# EAGLE design Rocket-Switch-Interface_1.011 (EAGLE 9.6.2)
AUTHOR: ladyada
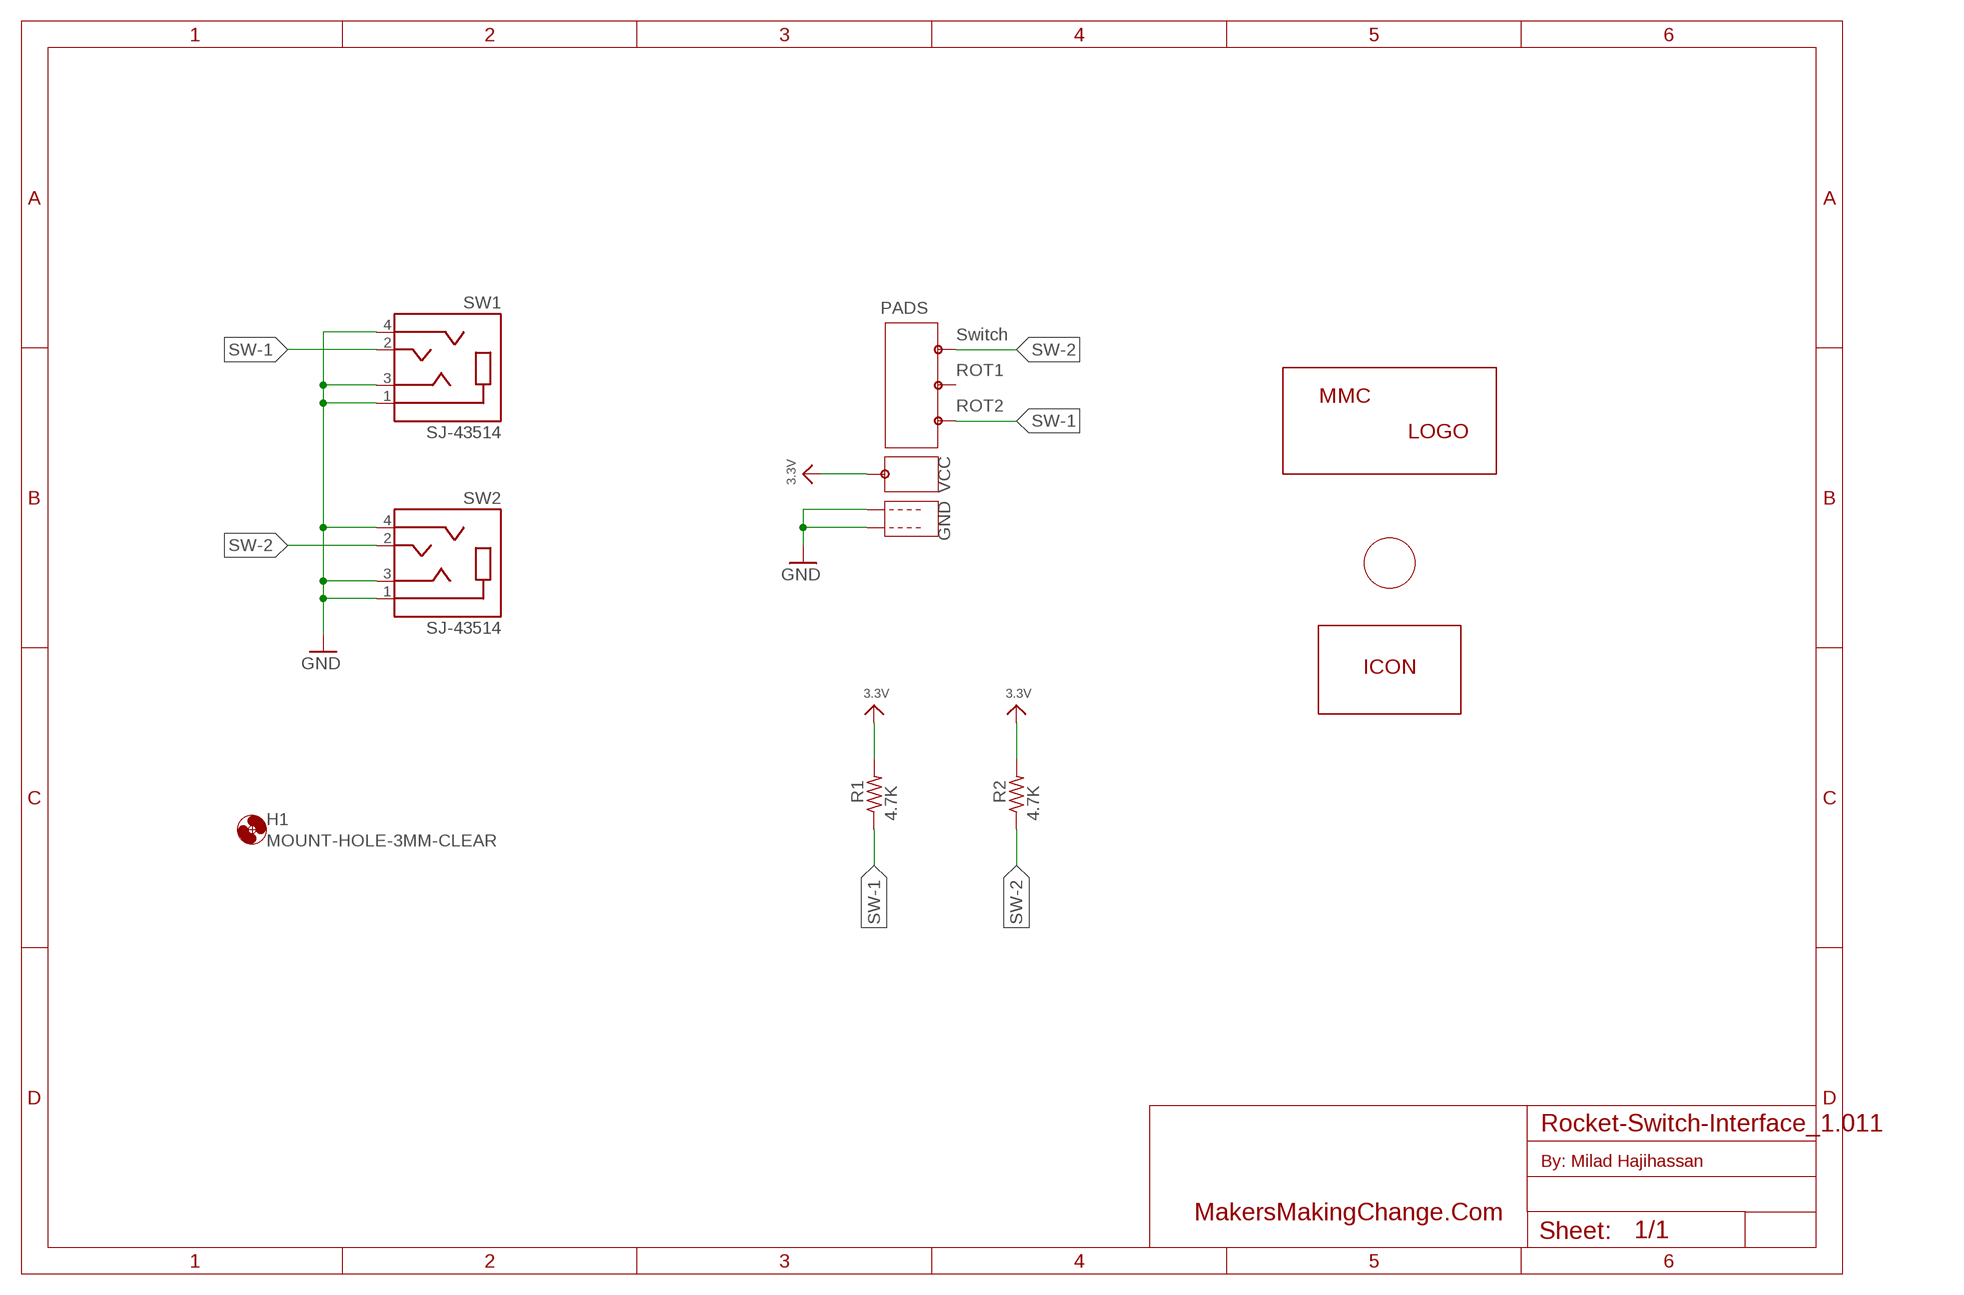
[diagram p0: schematic, sheet 1]

## Parts
H1  MOUNT-HOLE-3MM-CLEAR  [HOLE-3MM-CLEAR]
LABEL_BACKGROUND  MMC_ICON-ROCKET-SW  [ICON_ROCKET-SWITCH]
LABEL_DEVICE  MMC_LABEL-ROCKET-SW  [LABEL-ROCKET-SWITCH]
LABEL_LOGO  MMC_LOGO-XSM  [MMC_X-SMALL_LOGO]
PADS  PADS-ROTARY-TRINKEY-3  [PADS-ROTARY-TRINKEY-3]
R1  4.7K  RESISTOR-US-0204/5  [RESISTOR_0204/5]
R2  4.7K  RESISTOR-US-0204/5  [RESISTOR_0204/5]
SW1  SJ-43514  [CUI_SJ-43514]
SW2  SJ-43514  [CUI_SJ-43514]

## Nets
3.3V: PADS.P$VCC R1.2 R2.2
GND: PADS.P$GND1 PADS.P$GND2 SW1.1(SLEEVE) SW1.3(RING1) SW1.4(RING2) SW2.1(SLEEVE) SW2.3(RING1) SW2.4(RING2)
SW-1: PADS.P$ROT2 R1.1 SW1.2(TIP)
SW-2: PADS.P$SW R2.1 SW2.2(TIP)
Unconnected: PADS.P$ROT1

## Notes on the sheet
- By: Milad Hajihassan
- MakersMakingChange.Com

## Library data of the parts
H1 = MMC Eagle:MOUNT-HOLE-: MOUNTING HOLE with drill center marker
LABEL_BACKGROUND = MMC Eagle:MMC_ICON-
LABEL_DEVICE = MMC Eagle:MMC_LABEL-
LABEL_LOGO = MMC Eagle:MMC_LOGO-
PADS = MMC Eagle:PADS-ROTARY-TRINKEY: Rotary Encoder with Built-In Switch PEC11 - 24 Step, PEC11-4215F-S24 - http://www.adafruit.com/products/377
R1 R2 = MMC Eagle:RESISTOR-US-: RESISTOR, American symbol
SW1 SW2 = MMC Eagle:SJ-43514: SJ-43514 3.50mm (0.141", 1/8", Mini Plug) - Headphone Phone Jack Stereo (4 Conductor, TRRS) Connector. You can use these as jacks to connect analog joysticks or create simple switch interfaces. Options: Digikey - CP-43514-ND <https://www.digikey.ca/en/products/detail/cui-devices/SJ-43514/368146> Mouser - 490-SJ-43514 <https://www.mouser.ca/ProductDetail/CUI-Devices/SJ-43514?qs=WyjlAZoYn51bsBOfuwwiuw%3D%3D>

## Board
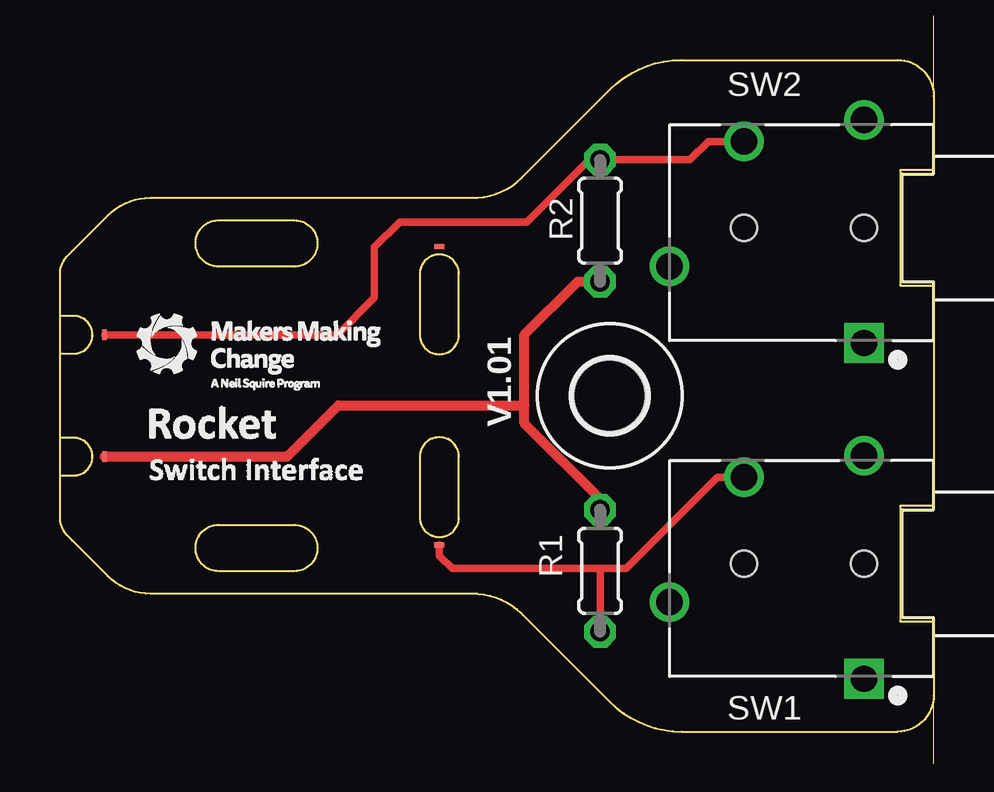
[diagram p1: board, top side]
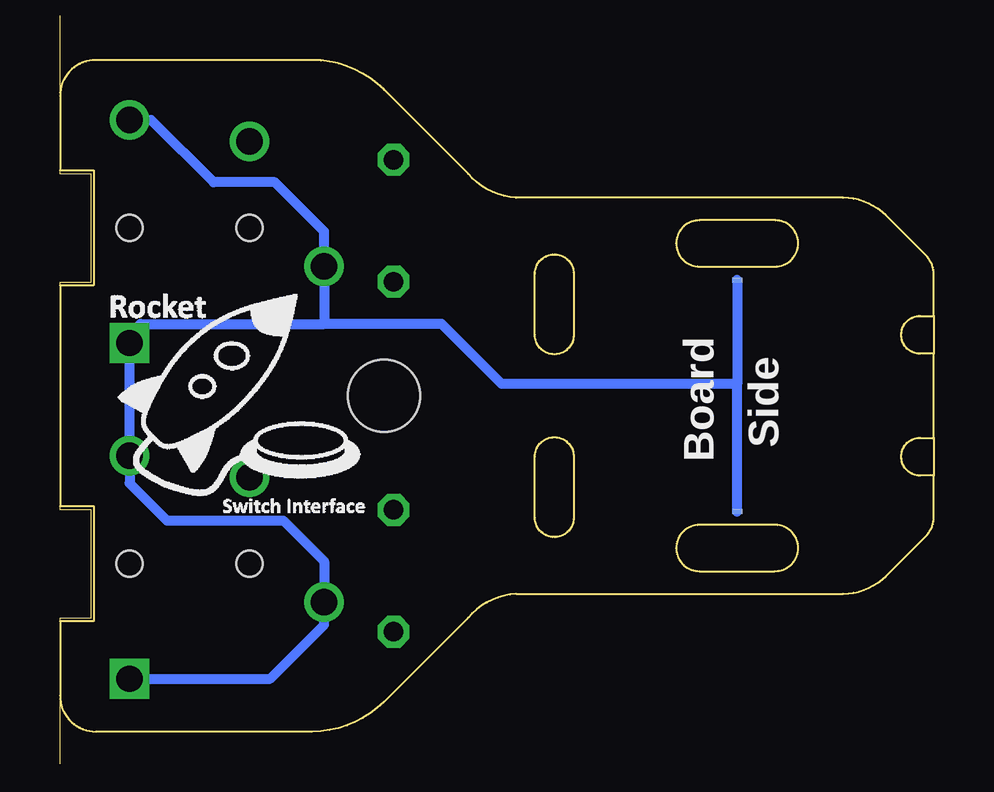
[diagram p2: board, bottom side, seen from below]

Size 36.4 x 28 mm. Coordinates in mm from the lower left corner, seen from the top.
Outline: 0.28,19.8 0.5,20.03 1.98,21.51 arc-45 3.78,22.25 17.4,22.25 arc45 19.4,23.25 22.9,26.75 arc-45 25.9,28 34.9,28 arc-90 36.4,26.5 36.4,23.4 35,23.4 35,18.6 36.4,18.6 36.4,9.4 35,9.4 35,4.6 36.4,4.6 36.4,1.5 arc-90 34.9,0 25.9,0 arc-45 22.9,1.25 19.4,4.75 arc45 17.4,5.75 3.78,5.75 arc-45 1.98,6.49 0.5,7.97 0.28,8.2 arc-35 0,8.85 0,10.67 0.57,10.67 arc90 1.35,11.46 arc90 0.57,12.25 0,12.25 0,15.75 0.57,15.75 arc90 1.35,16.54 arc90 0.57,17.33 0,17.33 0,19.15 arc-35 0.28,19.8
Copper layers (1*16): Top 0.035mm / dielectric 1.5mm / Bottom 0.035mm
Design rules "adafruit 8-8 *": minimum track width 8mil, minimum drill 15.5mil, track to track 8mil, track to pad 8mil, pad to pad 8mil, via to via 8mil, smd to smd 8mil, copper to edge 10mil, drill to drill 8mil, minimum pad ring 10mil, minimum via ring 8mil, stop-mask expansion 2mil, vias tented up to drill 20mil, thermal gap 10mil

### Footprints (pad centres in the part's own frame; a part is rotated, then mirrored left to right if it is on the bottom)
HOLE-3MM-CLEAR = hole 3: 0,0
PADS-ROTARY-TRINKEY-3 = smd 0.203 x 0.406 bottom: P$GND1 -4.826,0; P$GND2 4.826,0 | smd 0.203 x 0.406: P$ROT1 6.223,-7.62; P$ROT2 -6.223,-7.62 | smd 0.406 x 0.203: P$SW 2.54,6.325; P$VCC -2.54,6.325
RESISTOR_0204/5 = drill 0.813 octagon: 1 -2.54,0; 2 2.54,0
CUI_SJ-43514 = drill 1.1 square: 1 -2.6,4.8 | drill 1.1: 2 2.4,-3.6; 3 5.5,1.6; 4 -2.6,-4.5 | hole 1.1: -2.6,0; 2.4,0

### Placement (x,y rotation side)
H1  22.9,14 0 top
LABEL_BACKGROUND  27.9,12.8 0 bottom
LABEL_DEVICE  7.9,11.5 0 top
LABEL_LOGO  8.19,14.25 0 top
PADS  8.19,14 90 top
R1  22.5,6.7 90 top
R2  22.5,21.3 270 top
SW1  30.9,7 180 top
SW2  30.9,21 180 top

### Tracks (layer width: path | path; a pad name or v marks a point on that pad's centre or on a via)
3.3V
  Top 0.406: PADS.P$VCC 9.46,11.46 11.6,13.6 19.35,13.6 | R2.2 21.56,18.76 19.35,16.55 19.35,13.6 | R1.2 22.5,9.7 19.35,12.85 19.35,13.6
GND
  Bottom 0.406: SW2.4 32.6,25.5 30,22.9 27.45,22.9 25.4,20.85 SW2.3 25.4,17 | SW1.1 27.65,2.2 25.4,4.45 SW1.3 25.4,7.1 27.1,8.8 31.95,8.8 33.5,10.35 SW1.4 SW2.1 33.5,16.55 33.05,17 25.4,17 | 25.4,17 20.5,17 18,14.5 8.19,14.5 | PADS.P$GND2 8.19,14.5 | PADS.P$GND1 8.19,14.5
SW-1
  Top 0.305: 22.5,6.8 16.34,6.8 15.81,7.33 PADS.P$ROT2 | SW1.2 27.39,10.6 23.59,6.8 22.5,6.8 | R1.1 22.5,6.8
SW-2
  Top 0.305: SW2.2 27,24.6 26.24,23.84 R2.1 22.04,23.84 19.45,21.25 14.15,21.25 13.1,20.2 13.1,18.1 11.54,16.54 PADS.P$SW

### Text on the board
tPlace: V1.01
bPlace: Side | Board